# Altium schematic sheet dod1.SchDoc
size A4
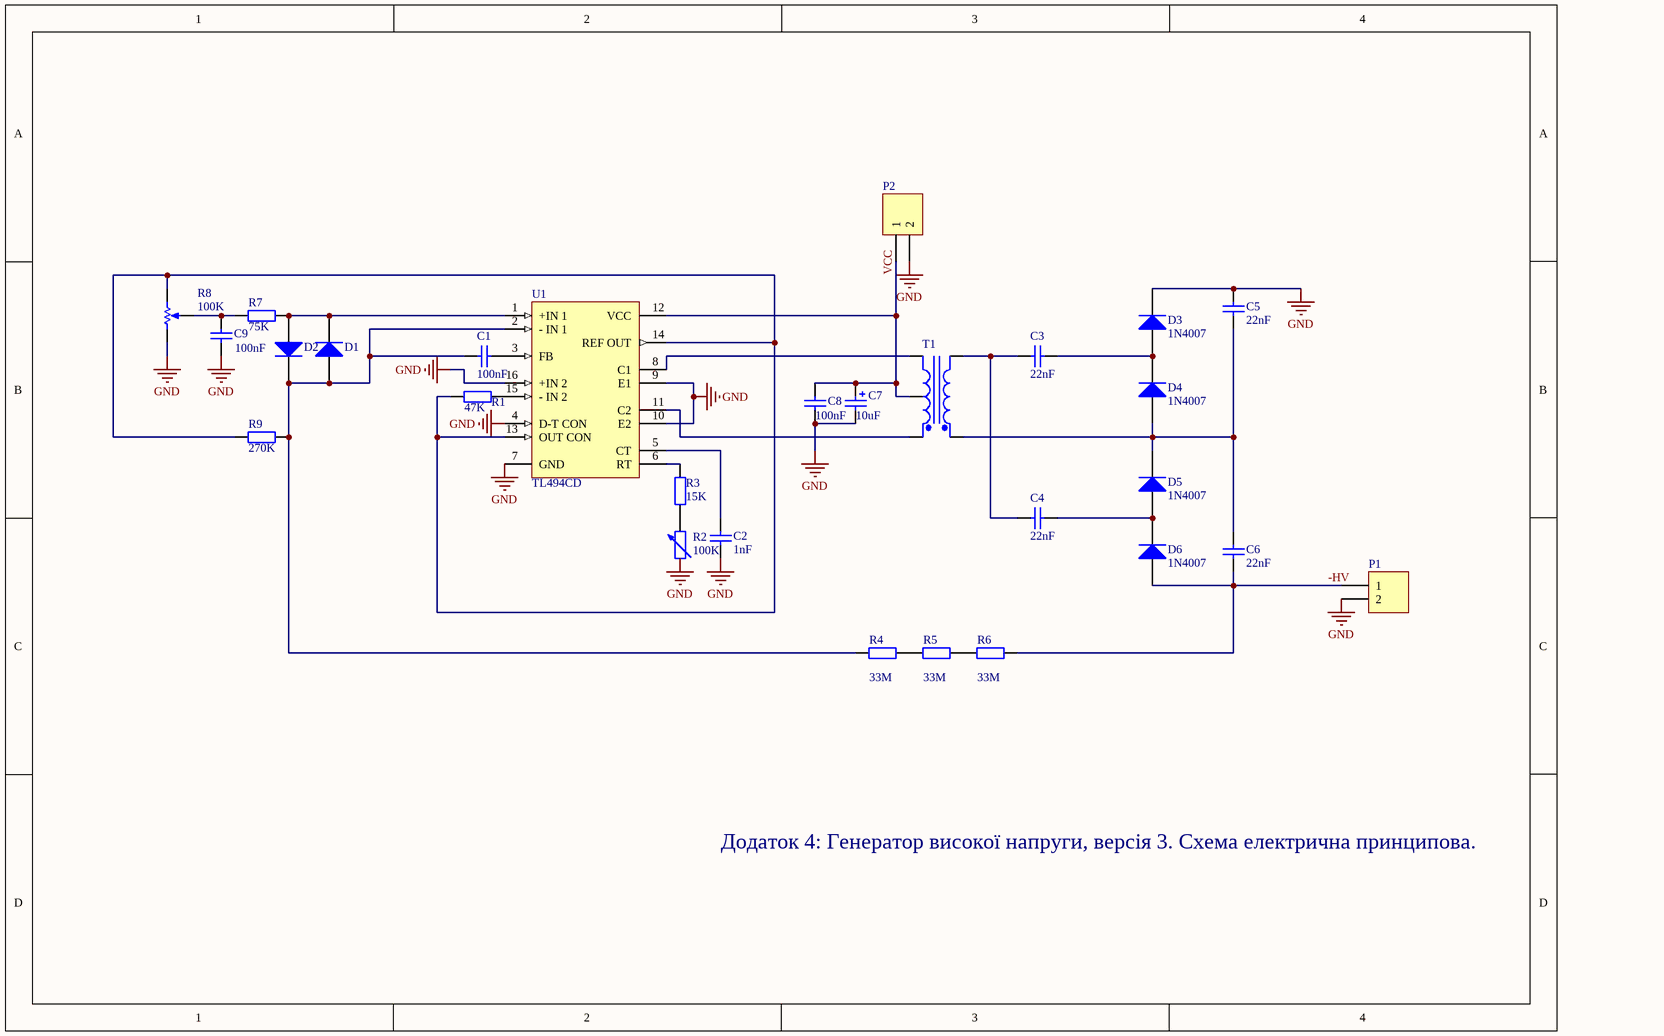
[diagram p0: dod1.SchDoc]

## Parts
C1  value 100nF  [RAD-0.3]  (hidden comment: Cap)
C2  value 1nF  [RAD-0.3]  (hidden comment: Cap)
C3  value 22nF  [RAD-0.3]  (hidden comment: Cap)
C4  value 22nF  [RAD-0.3]  (hidden comment: Cap)
C5  value 22nF  [RAD-0.3]  (hidden comment: Cap)
C6  value 22nF  [RAD-0.3]  (hidden comment: Cap)
C7  value 10uF  [POLAR0.8]  (hidden comment: Cap Pol2)
C8  value 100nF  [RAD-0.3]  (hidden comment: Cap)
C9  value 100nF  [RAD-0.3]  (hidden comment: Cap)
D1  Diode 1N914  [DO-35]  (value not drawn)
D2  Diode 1N914  [DO-35]  (value not drawn)
D3  1N4007  [DO-41]
D4  1N4007  [DO-41]
D5  1N4007  [DO-41]
D6  1N4007  [DO-41]
P1  Header 2  [HDR1X2]  (value not drawn)
P2  Header 2  [HDR1X2]  (value not drawn)
R1  value 47K  [AXIAL-0.4]  (hidden comment: Res2)
R2  value 100K  [AXIAL-0.6]  (hidden comment: Res Adj2)
R3  value 15K  [AXIAL-0.4]  (hidden comment: Res2)
R4  value 33M  [AXIAL-0.4]  (hidden comment: Res2)
R5  value 33M  [AXIAL-0.4]  (hidden comment: Res2)
R6  value 33M  [AXIAL-0.4]  (hidden comment: Res2)
R7  value 75K  [AXIAL-0.4]  (hidden comment: Res2)
R8  value 100K  [VR5]  (hidden comment: RPot)
R9  value 270K  [AXIAL-0.4]  (hidden comment: Res2)
T1  Trans CT  [TRF_5]  (value not drawn)
U1  TL494CD  [D016_N]

## Nets
GND: C2.2 C5.2 C7.2 C8.2 C9.1 D3.2(K) P1.2 P2.2 R8.1(TOP) U1.4(D-T_CON) U1.7(GND) U1.9(E1) U1.10(E2) U1.16(+IN_2)
-HV: C6.1 D6.1(A) P1.1 R6.2
VCC: C7.1 C8.1 P2.1 T1.4(SecCT) U1.12(VCC)
NetC1_1: C1.1 D1.1(A) D2.2(K) R4.1 R9.2 U1.2(-_IN_1)
NetC1_2: C1.2 U1.3(FB)
NetC2_1: C2.1 U1.5(CT)
NetC3_1: C3.1 C4.1 T1.2(Pri-)
NetC3_2: C3.2 D3.1(A) D4.2(K)
NetC4_2: C4.2 D5.1(A) D6.2(K)
NetC5_1: C5.1 C6.2 D4.1(A) D5.2(K) T1.1(Pri+)
NetC9_2: C9.2 R7.1 R8.3(TAP)
NetD1_2: D1.2(K) D2.1(A) R7.2 U1.1(+IN_1)
NetR1_1: R1.1 R8.2(BOT) R9.1 U1.13(OUT_CON) U1.14(REF_OUT)
NetR1_2: R1.2 U1.15(-_IN_2)
NetR2_2: R2.2 R3.1
NetR3_2: R3.2 U1.6(RT)
NetR4_2: R4.2 R5.1
NetR5_2: R5.2 R6.1
NetT1_3: T1.3(Sec+) U1.11(C2)
NetT1_5: T1.5(Sec-) U1.8(C1)

Not connected (* = marked no-connect by the designer): R2 1

## Notes on the sheet
- Додаток 4: Генератор високої напруги, версія 3. Схема електрична принципова.
- Labels drawn without touching a wire or pin: GND

## Library data of the parts
C1-C6 C8 C9 = Cap: Capacitor; Published: 8-Jun-2000; LatestRevisionDate: 17-Jul-2002; LatestRevisionNote: Re-released for DXP Platform.; PackageReference: RAD-0.3; Publisher: Altium Limited; PackageDescription: Radial Cap, Thru-Hole; 2 Leads; 0.3 in Pin Spacing
C7 = Cap Pol2: Polarized Capacitor (Axial); Published: 8-Jun-2000; LatestRevisionDate: 17-Jul-2002; LatestRevisionNote: Re-released for DXP Platform.; PackageReference: POLAR0.8; Publisher: Altium Limited; PackageDescription: Polarized Capacitor; 2 Leads
D1 D2 = Diode 1N914: High Conductance Fast Diode; Published: 8-Jun-2000; LatestRevisionDate: 17-Jul-2002; LatestRevisionNote: Re-released for DXP Platform.; DatasheetVersion: 1997; PackageReference: DO-35; Publisher: Altium Limited; PackageDescription: Diode, Axial; Body 3.8 x 1.9 mm (LxDia. max), Lead Dia. 0.53 mm (max); Code_JEDEC: DO-204-AH; ComponentLink1Description: Manufacturer Link; ComponentLink1URL: http://www.fairchildsemi.com/; ComponentLink2Description: Datasheet; ComponentLink2URL: http://www.fairchildsemi.com/ds/1N%2F1N4448.pdf
D3-D6 = Diode 1N4007: 1 Amp General Purpose Rectifier; Published: 8-Jun-2000; LatestRevisionDate: 17-Jul-2002; LatestRevisionNote: Re-released for DXP Platform.; DatasheetVersion: 1998; PackageVersion: Aug-1999; PackageReference: DO-41; Publisher: Altium Limited; PackageDescription: Diode, Axial; Body 5.2 x 2.7 mm (LxDia. max), Lead Dia. 0.86 mm (max); Code_JEDEC: DO-204-AL; ComponentLink1Description: Manufacturer Link; ComponentLink1URL: http://www.fairchildsemi.com/; ComponentLink2Description: Datasheet; ComponentLink2URL: http://www.fairchildsemi.com/ds/1N%2F1N4001.pdf
P1 P2 = Header 2: Header, 2-Pin; LatestRevisionDate: 17-Jul-2002; LatestRevisionNote: Re-released for DXP Platform.; Publisher: Altium Limited
R1 R3-R7 R9 = Res2: Resistor; Published: 8-Jun-2000; LatestRevisionDate: 17-Jul-2002; LatestRevisionNote: Re-released for DXP Platform.; PackageReference: AXIAL-0.4; Publisher: Altium Limited; PackageDescription: Axial Device, Thru-Hole; 2 Leads; 0.4 in Pin Spacing
R2 = Res Adj2: Variable Resistor; Set Position: 0.5; Published: 8-Jun-2000; LatestRevisionDate: 17-Jul-2002; LatestRevisionNote: Re-released for DXP Platform.; PackageReference: AXIAL-0.6; Publisher: Altium Limited; PackageDescription: Axial Device, Thru-Hole; 2 Leads; 0.6 in Pin Spacing
R8 = RPot: Potentiometer; Sim Note: Enter the Resistance value and the set point into parameter fields.; Set Position: 0.5; Published: 8-Jun-2000; LatestRevisionDate: 17-Jul-2002; LatestRevisionNote: Re-released for DXP Platform.; PackageReference: VR5; Publisher: Altium Limited; PackageDescription: Variable Resistor, Thru-Hole; 3 Leads
T1 = Trans CT: Center-Tapped Transformer (Coupled Inductor Model); Published: 8-Jun-2000; LatestRevisionDate: 17-Jul-2002; LatestRevisionNote: Re-released for DXP Platform.; PackageReference: TRF_5; Publisher: Altium Limited; PackageDescription: Transformer; 5 Leads
U1 = TL494CD: Pulse-Width-Modulation Control Circuit; Published: 15-Apr-2002; LatestRevisionDate: 13-Apr-2006; LatestRevisionNote: IPC-7351 Footprint Added.; DatasheetVersion: Oct-1988; PackageVersion: Jan-1998; PackageReference: D016; Publisher: Altium Limited; PackageDescription: 16-Pin Small Outline Integrated Circuit 1.27 mm Pitch; Code_IPC: SOIC127P600-16; ComponentLink1Description: Manufacturer Link; ComponentLink1URL: http://www.ti.com/